# EasyEDA Pro project 数控buck.eprj

# Schematic Schematic1
Board Name: Board1; Create Date: 2025-03-31; Page Name: P1; Project Name: 数控buck; Schematic Name: Schematic1; Update Date: 2025-04-08; Company: 嘉立创EDA; Page Size: A4; Version: V1.0
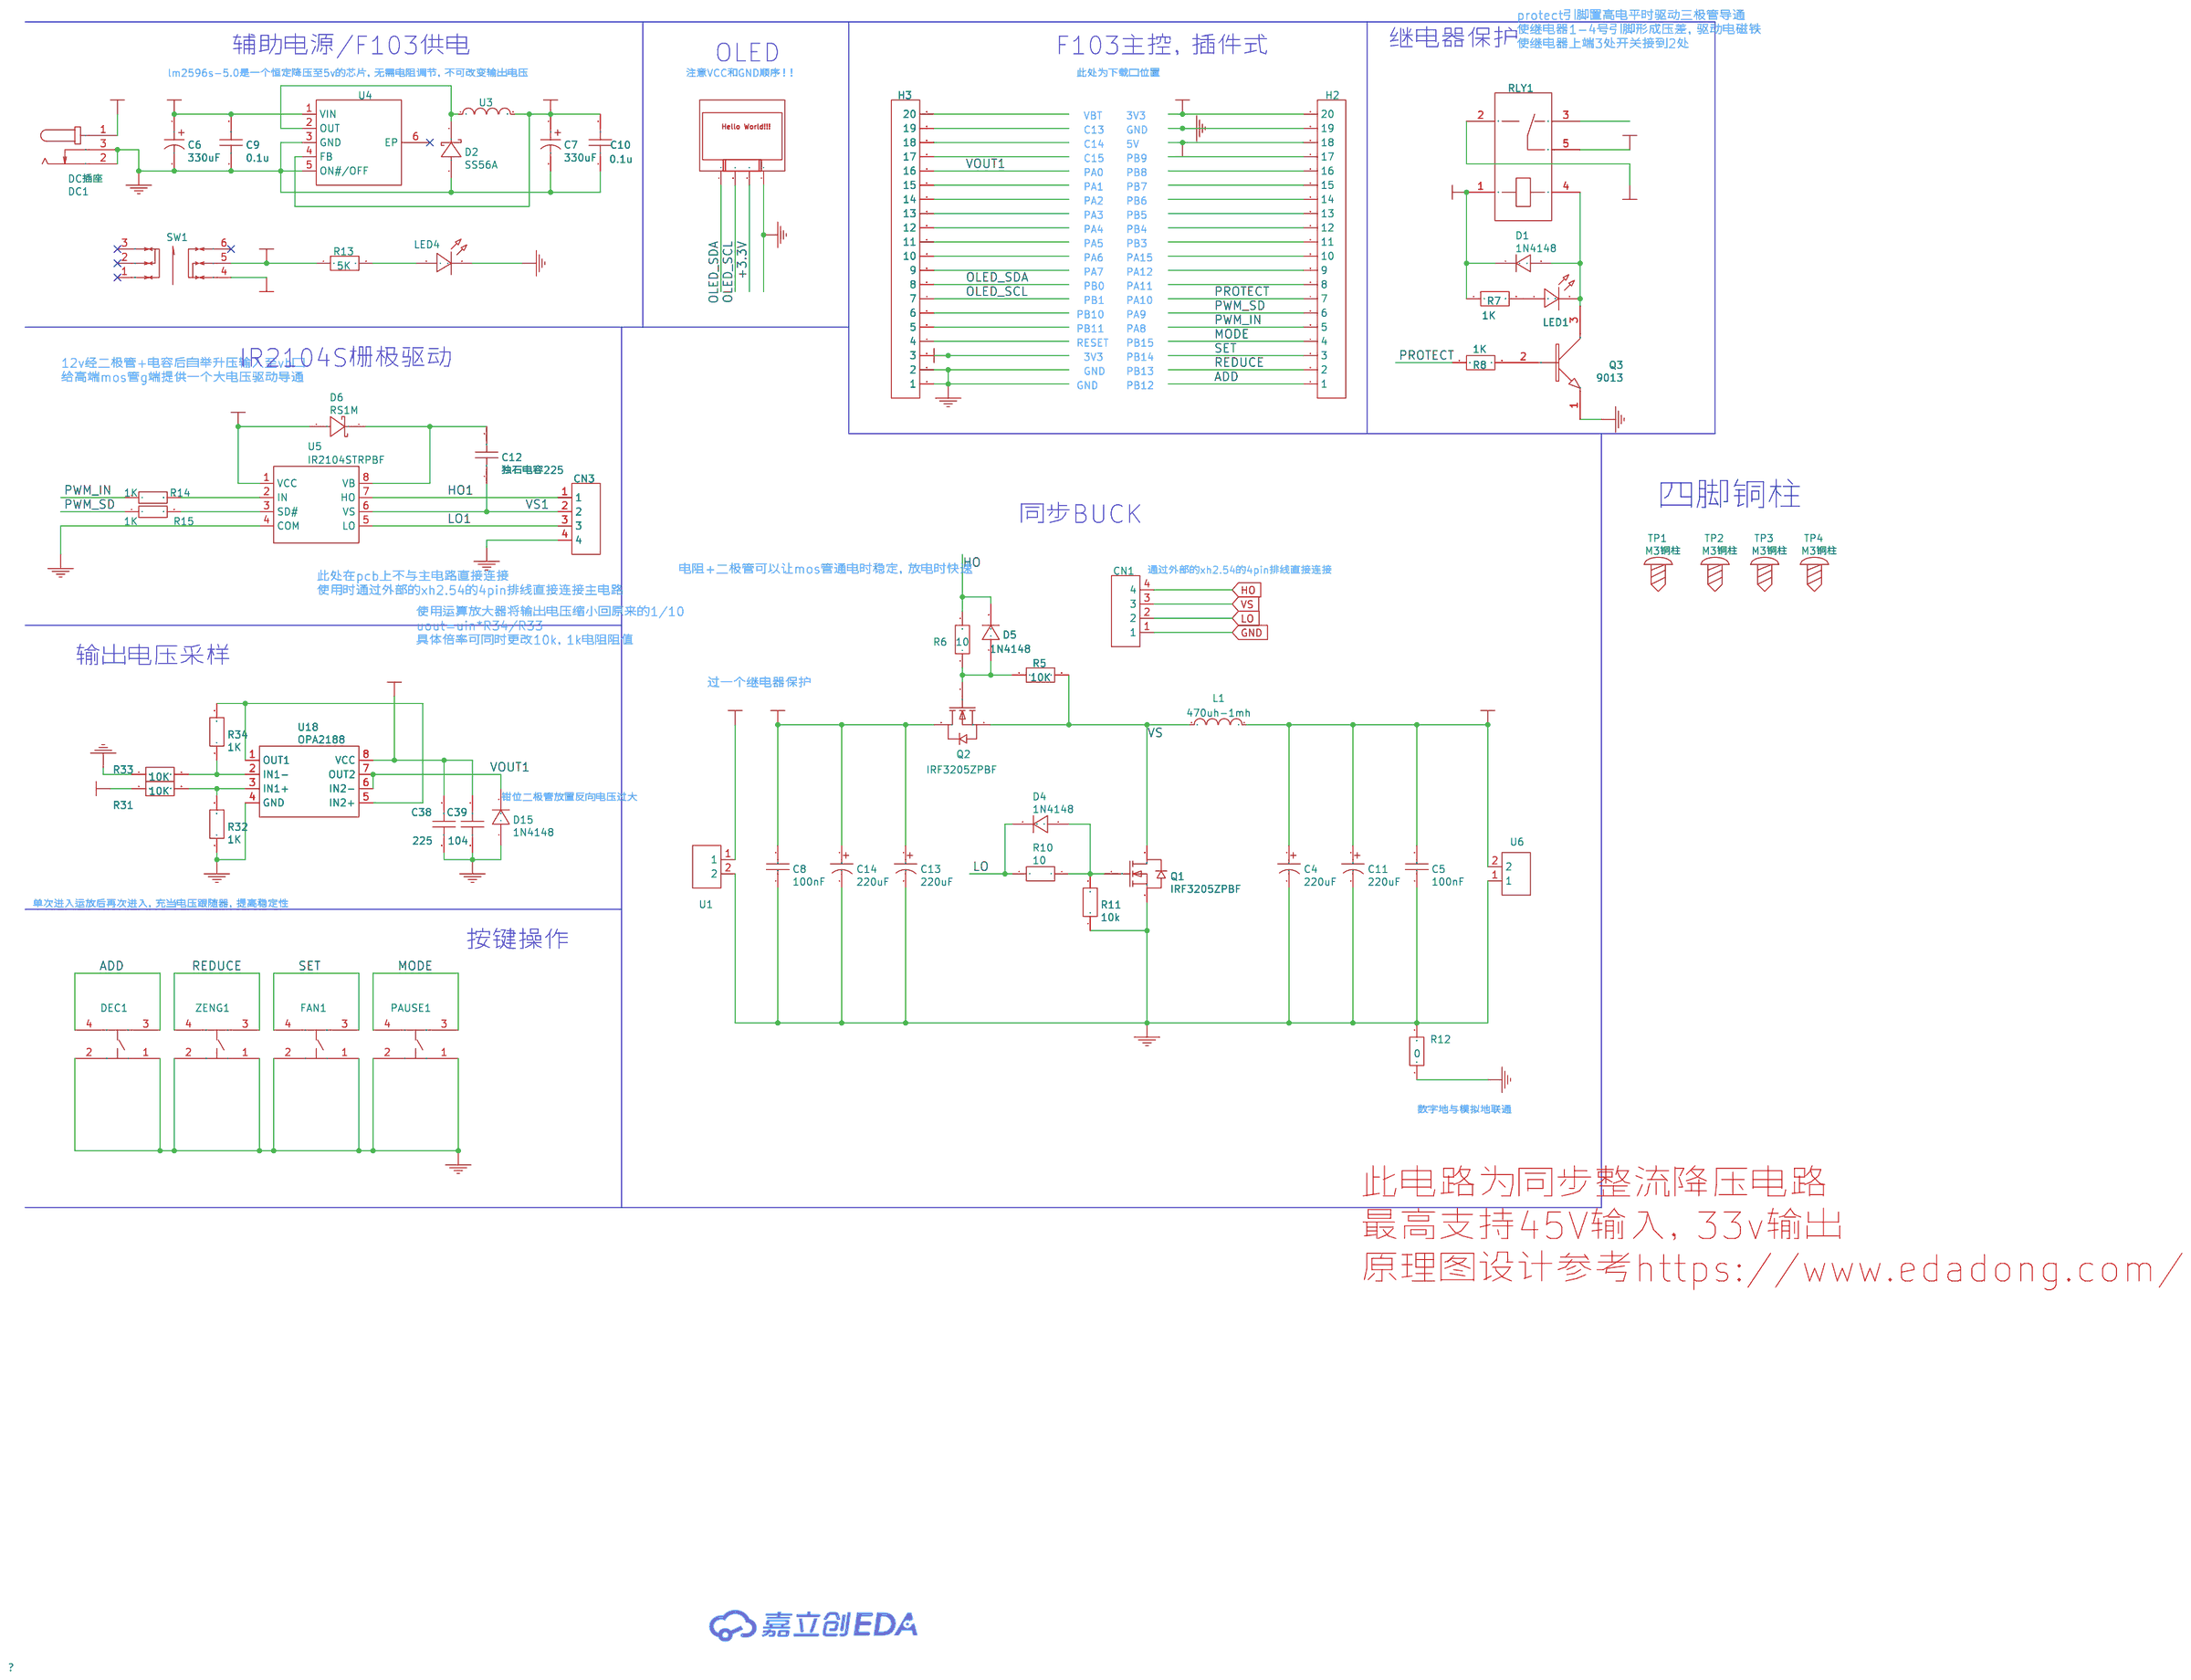
[diagram p0: schematic sheet]

## Parts
C4  220uF  [CAP-TH_BD10.0-P5.00-D1.0-FD]
C5  100nF  [CAP-TH_L8.5-W5.0-P5.00-D1.2]
C6  330uF  [CAP-SMD_BD10.0-L10.3-W10.3-LS11.0-R-RD]
C7  330uF  [CAP-SMD_BD10.0-L10.3-W10.3-LS11.0-R-RD]
C8  100nF  [CAP-TH_L8.5-W5.0-P5.00-D1.2]
C9  0.1u  [C0805]
C10  0.1u  [C0805]
C11  220uF  [CAP-TH_BD10.0-P5.00-D1.0-FD]
C12  独石电容225  [独石电容]
C13  220uF  [CAP-TH_BD10.0-P5.00-D1.0-FD]
C14  220uF  [CAP-TH_BD10.0-P5.00-D1.0-FD]
C38  225  [C0805]
C39  104  [C0805]
CN1  XH-4A_C2908602  [CONN-TH_XH2.50-4P]
CN3  XH-4A_C2908602  [CONN-TH_XH2.50-4P]
D1  1N4148  [DO-35_BD2.0-L4.2-P8.20-D0.5-RD]
D2  SS56A  [SMA_L4.2-W2.6-LS5.0-RD]
D4  1N4148  [DO-35_BD2.0-L4.0-P8.00-D0.5-FD]
D5  1N4148  [DO-35_BD2.0-L4.0-P8.00-D0.5-FD]
D6  RS1M  [SMA_L4.4-W2.8-LS5.4-RD]
D15  1N4148  [DO-35_BD2.0-L4.0-P8.00-D0.5-FD]
DC1  DC插座  [DC-IN-TH_DC-005-5A-2.0]
DEC1  6*6*5_C69330  [KEY-TH_4P-L6.0-W6.0-P4.50-LS6.5]
FAN1  6*6*5_C69330  [KEY-TH_4P-L6.0-W6.0-P4.50-LS6.5]
H2  HDR-F-2.54_1x20  [HDR-F-2.54_1X20]
H3  HDR-F-2.54_1x20  [HDR-F-2.54_1X20]
L1  470uh-1mh  [电感PCB]
LED1  LED-TH-3mm_R  [LED-TH_BD3.0_RED]
LED4  LED-TH-3mm_R  [LED-TH_BD3.0_RED]
OLED1  0.96OLED_4P  [0.96OLED_4P]
PAUSE1  6*6*5_C69330  [KEY-TH_4P-L6.0-W6.0-P4.50-LS6.5]
Q1  IRF3205ZPBF  [TO-220-3_L10.0-W4.5-P2.54-T]
Q2  IRF3205ZPBF  [TO-220-3_L10.0-W4.5-P2.54-T]
Q3  9013  [TO-92]
R5  10K  [R0805]
R6  10  [R0805]
R7  1K  [R0805]
R8  1K  [R0805]
R10  10  [R0805]
R11  10k  [R0805]
R12  0  [R0805]
R13  5K  [R0805]
R14  1K  [R0805]
R15  1K  [R0805]
R31  10K  [R0805]
R32  1K  [R0805]
R33  10K  [R0805]
R34  1K  [R0805]
RLY1  SRD-05VDC-SL-C  [RELAY-TH_SRD-XXVDC-XL-C]
SW1  XKB8080-Z  [SW-TH_6P-L8.0-W8.0-P2.50]
TP1  M3铜柱  [M3铜柱]
TP2  M3铜柱  [M3铜柱]
TP3  M3铜柱  [M3铜柱]
TP4  M3铜柱  [M3铜柱]
U1  KF7.62-2P  [CONN-TH_KF7.62-2P]
U3  CDRH125L125NP-151MC  [IND-SMD_L12.0-W12.0_CDRH125L125NP-470MC]
U4  LM2596S-5.0  [TO-263-5_L10.2-W8.9-P1.70-BR]
U5  IR2104STRPBF  [SOIC-8_L4.9-W3.9-P1.27-LS6.0-BL]
U6  KF7.62-2P  [CONN-TH_KF7.62-2P]
U18  OPA2188  [SOP-8_L4.9-W3.9-P1.27-LS6.0-BL]
ZENG1  6*6*5_C69330  [KEY-TH_4P-L6.0-W6.0-P4.50-LS6.5]

## Library data of the parts
C4 C11 C13 C14 = 220uF: Supplier: LCSC; Manufacturer: CX(承兴); Manufacturer Part: KM227M050G13RR0VH2FP0; Supplier Part: C45105; JLCPCB Part Class: Extended Part
C5 C8 = 100nF: Supplier: LCSC; Manufacturer: FH; Manufacturer Part: CT4-0805Y104M500F3; Supplier Part: C94717; JLCPCB Part Class: Extended Part
C6 C7 = 330uF: Supplier: LCSC; Supplier Part: C542207; Manufacturer: PANASONIC(松下); Manufacturer Part: EEEFT1H331GP
C9 C10 = 0.1u
C12 = 225: Supplier: LCSC; Supplier Part: 独石电容5.08; Manufacturer: 独石电容5.08; Manufacturer Part: 独石电容5.08
C38 = 225
C39 = 104
CN1 CN3 = XH-4A_C2908602: Supplier: LCSC; Supplier Part: C2908602; Manufacturer: HCTL(华灿天禄); Manufacturer Part: XH-4A; JLCPCB Part Class: Extended Part
D1 = 1N4148: Supplier: LCSC; Supplier Part: C13769; Manufacturer: STMicroelectronics
D2 = SS56A: Supplier: LCSC; Supplier Part: C842793; Manufacturer: FUXINSEMI; JLCPCB Part Class: Extended Part
D4 D5 D15 = 1N4148: Supplier: LCSC; Manufacturer: SEMTECH; Supplier Part: C14516
D6 = RS1M: Supplier: LCSC; Supplier Part: C915738; Manufacturer: Agertech; Manufacturer Part: SS34AT
DC1 = DC插座: Supplier: LCSC; Supplier Part: C381116; Manufacturer: XKB Enterprise; Manufacturer Part: DC-005-5A-2.0
DEC1 FAN1 PAUSE1 ZENG1 = 6*6*5_C69330: Supplier: LCSC; Manufacturer: ReliaPro; Manufacturer Part: 6*6*5 直插环保260G 耐温复银; Supplier Part: C69330
H2 H3 = HDR-F-2.54_1x20: Supplier Part: C50984; Supplier: LCSC
L1 = 470uh-1mh
LED1 LED4 = LED-TH-3mm_R: Manufacturer: EVERLIGHT(台湾亿光); Manufacturer Part: 204-10SDRD/S530-A3-L; Supplier Part: C84774; Supplier: LCSC
OLED1 = 0.96OLED_4P: Supplier: LCSC
Q1 Q2 = IRF3205ZPBF: Supplier: LCSC; Manufacturer: Infineon; Supplier Part: C2612; JLCPCB Part Class: Extended Part
Q3 = 9013
R5 R31 R33 = 10K
R6 R10 = 10
R7 R8 R32 R34 = 1K
R11 = 10k
R12 = 0
R13 = 5K
R14 R15 = 1K: Supplier: LCSC; Supplier Part: C269727; Manufacturer: Tyohm; Manufacturer Part: RMC08051K5%N
RLY1 = SRD-05VDC-SL-C: Supplier: LCSC; Manufacturer: SONGLE; Supplier Part: C35449; JLCPCB Part Class: Extended Part
SW1 = XKB8080-Z: Supplier: LCSC; Supplier Part: C318860; Manufacturer: XKB Enterprise; JLCPCB Part Class: Extended Part
TP1-TP4 = M3铜柱
U1 U6 = KF7.62-2P: Supplier: LCSC; Supplier Part: C707824; Manufacturer: Cixi Kefa Elec; JLCPCB Part Class: Extended Part
U3 = CDRH125L125NP-151MC: Supplier: LCSC; Supplier Part: C2595958; Manufacturer: Sumida(胜美达); link: https://atta.szlcsc.com/upload/public/pdf/source/20180125/C167260_15168650590171302964.pdf; Inductance: 150uH
U4 = LM2596S-5.0: Supplier: LCSC; Supplier Part: C347421; Manufacturer: UMW(Youtai Semiconductor Co., Ltd.); JLCPCB Part Class: Extended Part
U5 = IR2104STRPBF: Supplier: LCSC; Manufacturer: IR; image: //image.lceda.cn/szlcsc/C2960.jpg; Supplier Part: C2960; Paste Type: recommend
U18 = OPA2188: Supplier: LCSC; Supplier Part: C3294649; Manufacturer: DOWO(东沃); Manufacturer Part: LM358

## Nets
+3.3V: H2.20 H3.3 OLED1.2
+5V: C7.1 C10.2 C38.1 C39.1 D1.1 H2.18 R7.1 RLY1.1 U3.2 U4.4(FB) U18.8(VCC)
+12V: C6.1 C9.2 D6.2(A) R13.1 SW1.5 U4.1(VIN) U5.1(VCC)
DGND: C6.2 C7.2 C9.1 C10.1 C38.2 C39.2 D2.2(A) D15.1 DC1.2 DC1.3 DEC1.1 DEC1.2 FAN1.1 FAN1.2 H2.19 H3.1 H3.2 LED4.2 OLED1.1 PAUSE1.1 PAUSE1.2 Q3.1(E) R12.1 U4.3(GND) U4.5(ON#/OFF) U5.4(COM) ZENG1.1 ZENG1.2
GND: C4.2 C5.1 C8.1 C11.2 C13.2 C14.2 CN1.1 Q1.3(S) R11.1 R12.2 R32.1 R33.1 U1.2 U6.1 U18.4(GND)
GND1: CN3.4
VCC: DC1.1 SW1.4
VIN: RLY1.5 U1.1
VIN_LATER: C8.2 C13.1 C14.1 Q2.2(D) RLY1.2
ADD: DEC1.3 DEC1.4 H2.1
HO: CN1.4 D5.2 R6.2
HO1: CN3.1 U5.7(HO)
LO: CN1.2 D4.2 R10.2
LO1: CN3.3 U5.5(LO)
MODE: H2.4 PAUSE1.3 PAUSE1.4
OLED_SCL: H3.7 OLED1.3
OLED_SDA: H3.8 OLED1.4
PROTECT: H2.7 R8.1
PWM_IN: H2.5 R14.1
PWM_SD: H2.6 R15.1
REDUCE: H2.2 ZENG1.3 ZENG1.4
SET: FAN1.3 FAN1.4 H2.3
VOUT: C4.1 C5.2 C11.1 L1.1 R31.1 U6.2
VOUT1: D15.2 H3.16 U18.6(IN2-) U18.7(OUT2)
VS: CN1.3 L1.2 Q1.2(D) Q2.3(S) R5.2
VS1: C12.1 CN3.2 U5.6(VS)
$1N20329: Q3.2(B) R8.2
$1N20344: D1.2 LED1.2 Q3.3(C) RLY1.4
$1N20345: LED1.1 R7.2
$1N20380: R33.2 R34.1 U18.2(IN1-)
$1N20381: R31.2 R32.2 U18.3(IN1+)
$1N20389: R34.2 U18.1(OUT1) U18.5(IN2+)
$1N20401: D2.1(K) U3.1 U4.2(OUT)
$1N20402: R14.2 U5.2(IN)
$1N20403: R15.2 U5.3(SD#)
$1N20406: C12.2 D6.1(K) U5.8(VB)
$1N20412: LED4.1 R13.2
$1N20418: D4.1 Q1.1(G) R10.1 R11.2
$1N20419: D5.1 Q2.1(G) R5.1 R6.1

Not connected (* = marked no-connect by the designer): H2 8 9 10 11 12 13 14 15 16 17; H3 4 5 6 9 10 11 12 13 14 15 17 18 19 20; RLY1 3; SW1 1* 2* 3* 6*; U4 6(EP)*

## Notes on the sheet
- 辅助电源/F103供电
- OLED
- F103主控，插件式
- 继电器保护
- protect引脚置高电平时驱动三极管导通
  使继电器1-4号引脚形成压差，驱动电磁铁
  使继电器上端3处开关接到2处
- lm2596s-5.0是一个恒定降压至5v的芯片，无需电阻调节，不可改变输出电压
- 注意VCC和GND顺序！！
- 此处为下载口位置
- VBT
- 3V3
- C13
- C14
- 5V
- GND
- C15
- PB9
- PA0
- PB8
- PA1
- PB7
- PA2
- PB6
- PA3
- PB5
- PA4
- PA5
- PB3
- PB4
- PA6
- PA15
- PA7
- PA12
- PB0
- PA11
- PB1
- PA10
- PB10
- PB11
- PA8
- PA9
- RESET
- PB15
- 3V3
- PB14
- 12v经二极管+电容后自举升压输入至vb口
  给高端mos管g端提供一个大电压驱动导通
- IR2104S栅极驱动
- GND
- PB13
- GND
- PB12
- 四脚铜柱
- 同步BUCK
- 电阻+二极管可以让mos管通电时稳定，放电时快速
- 通过外部的xh2.54的4pin排线直接连接
- 此处在pcb上不与主电路直接连接
  使用时通过外部的xh2.54的4pin排线直接连接主电路
- 使用运算放大器将输出电压缩小回原来的1/10
  uout=uin*R34/R33
  具体倍率可同时更改10k，1k电阻阻值
- 输出电压采样
- 过一个继电器保护
- 钳位二极管放置反向电压过大
- 单次进入运放后再次进入，充当电压跟随器，提高稳定性
- 按键操作
- 数字地与模拟地联通
- 此电路为同步整流降压电路
  最高支持45V输入，33v输出
  原理图设计参考https://www.edadong.com/

# Board PCB1
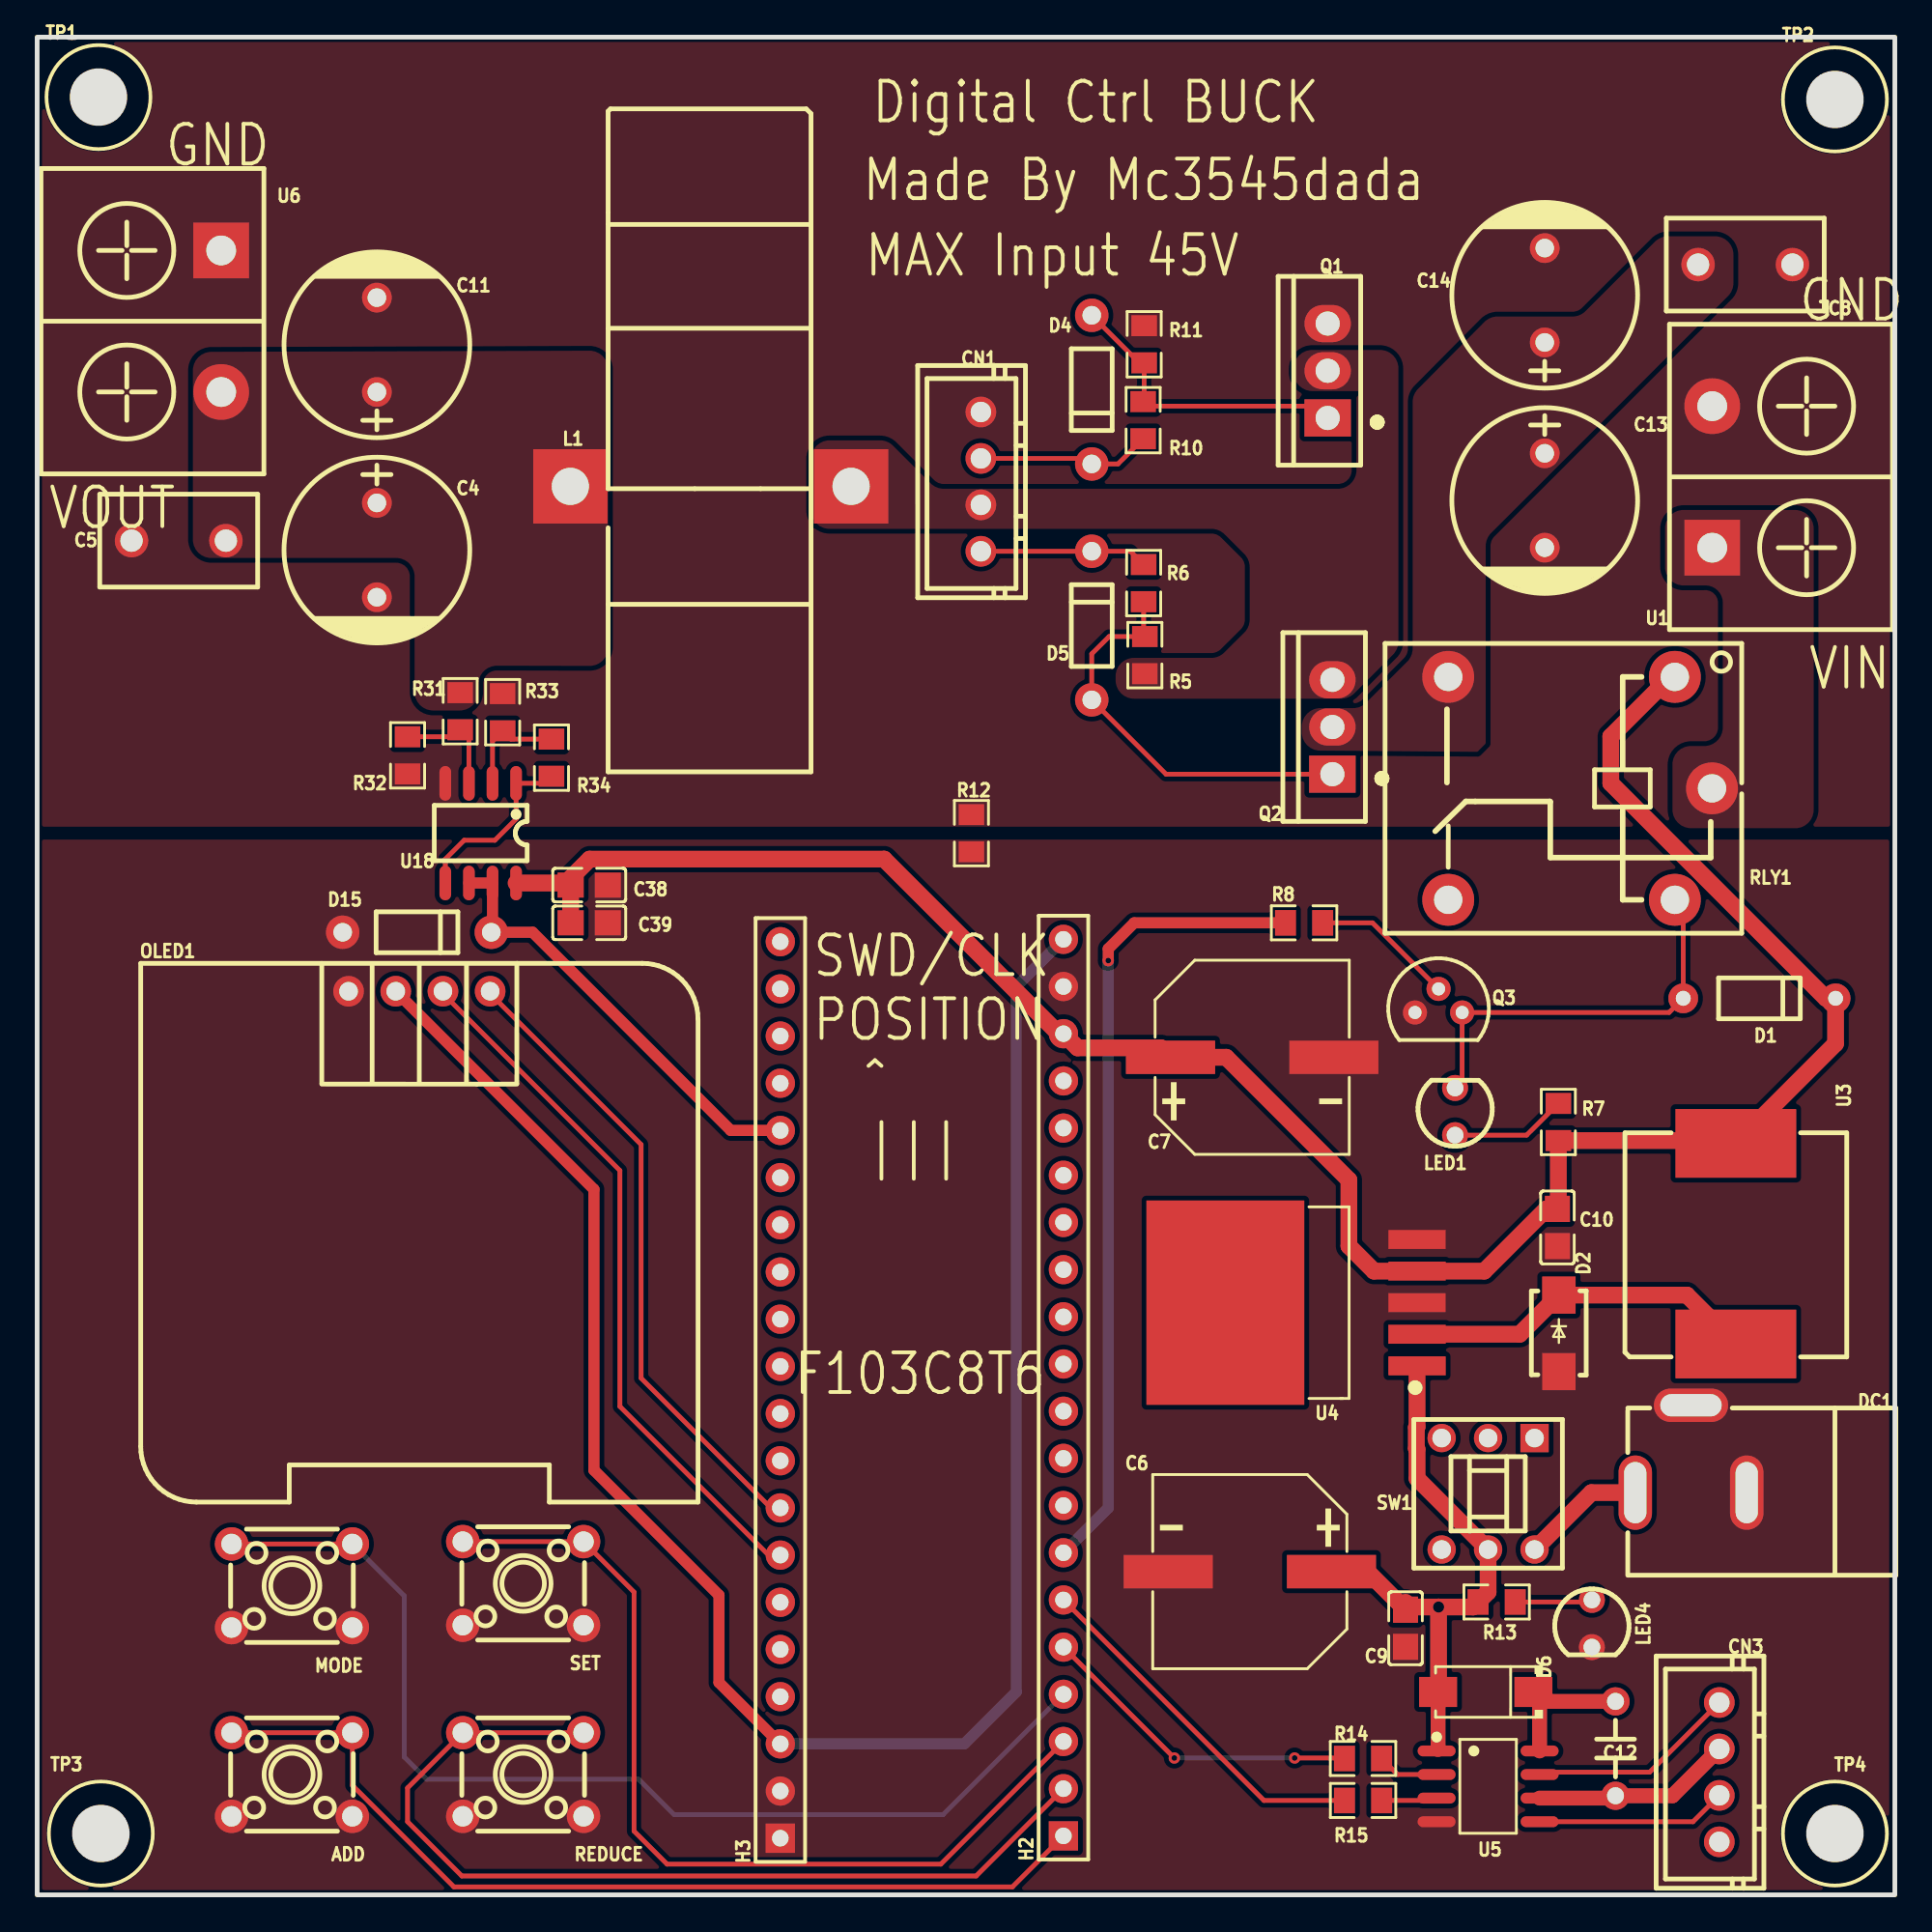
[diagram p1: board, top side]
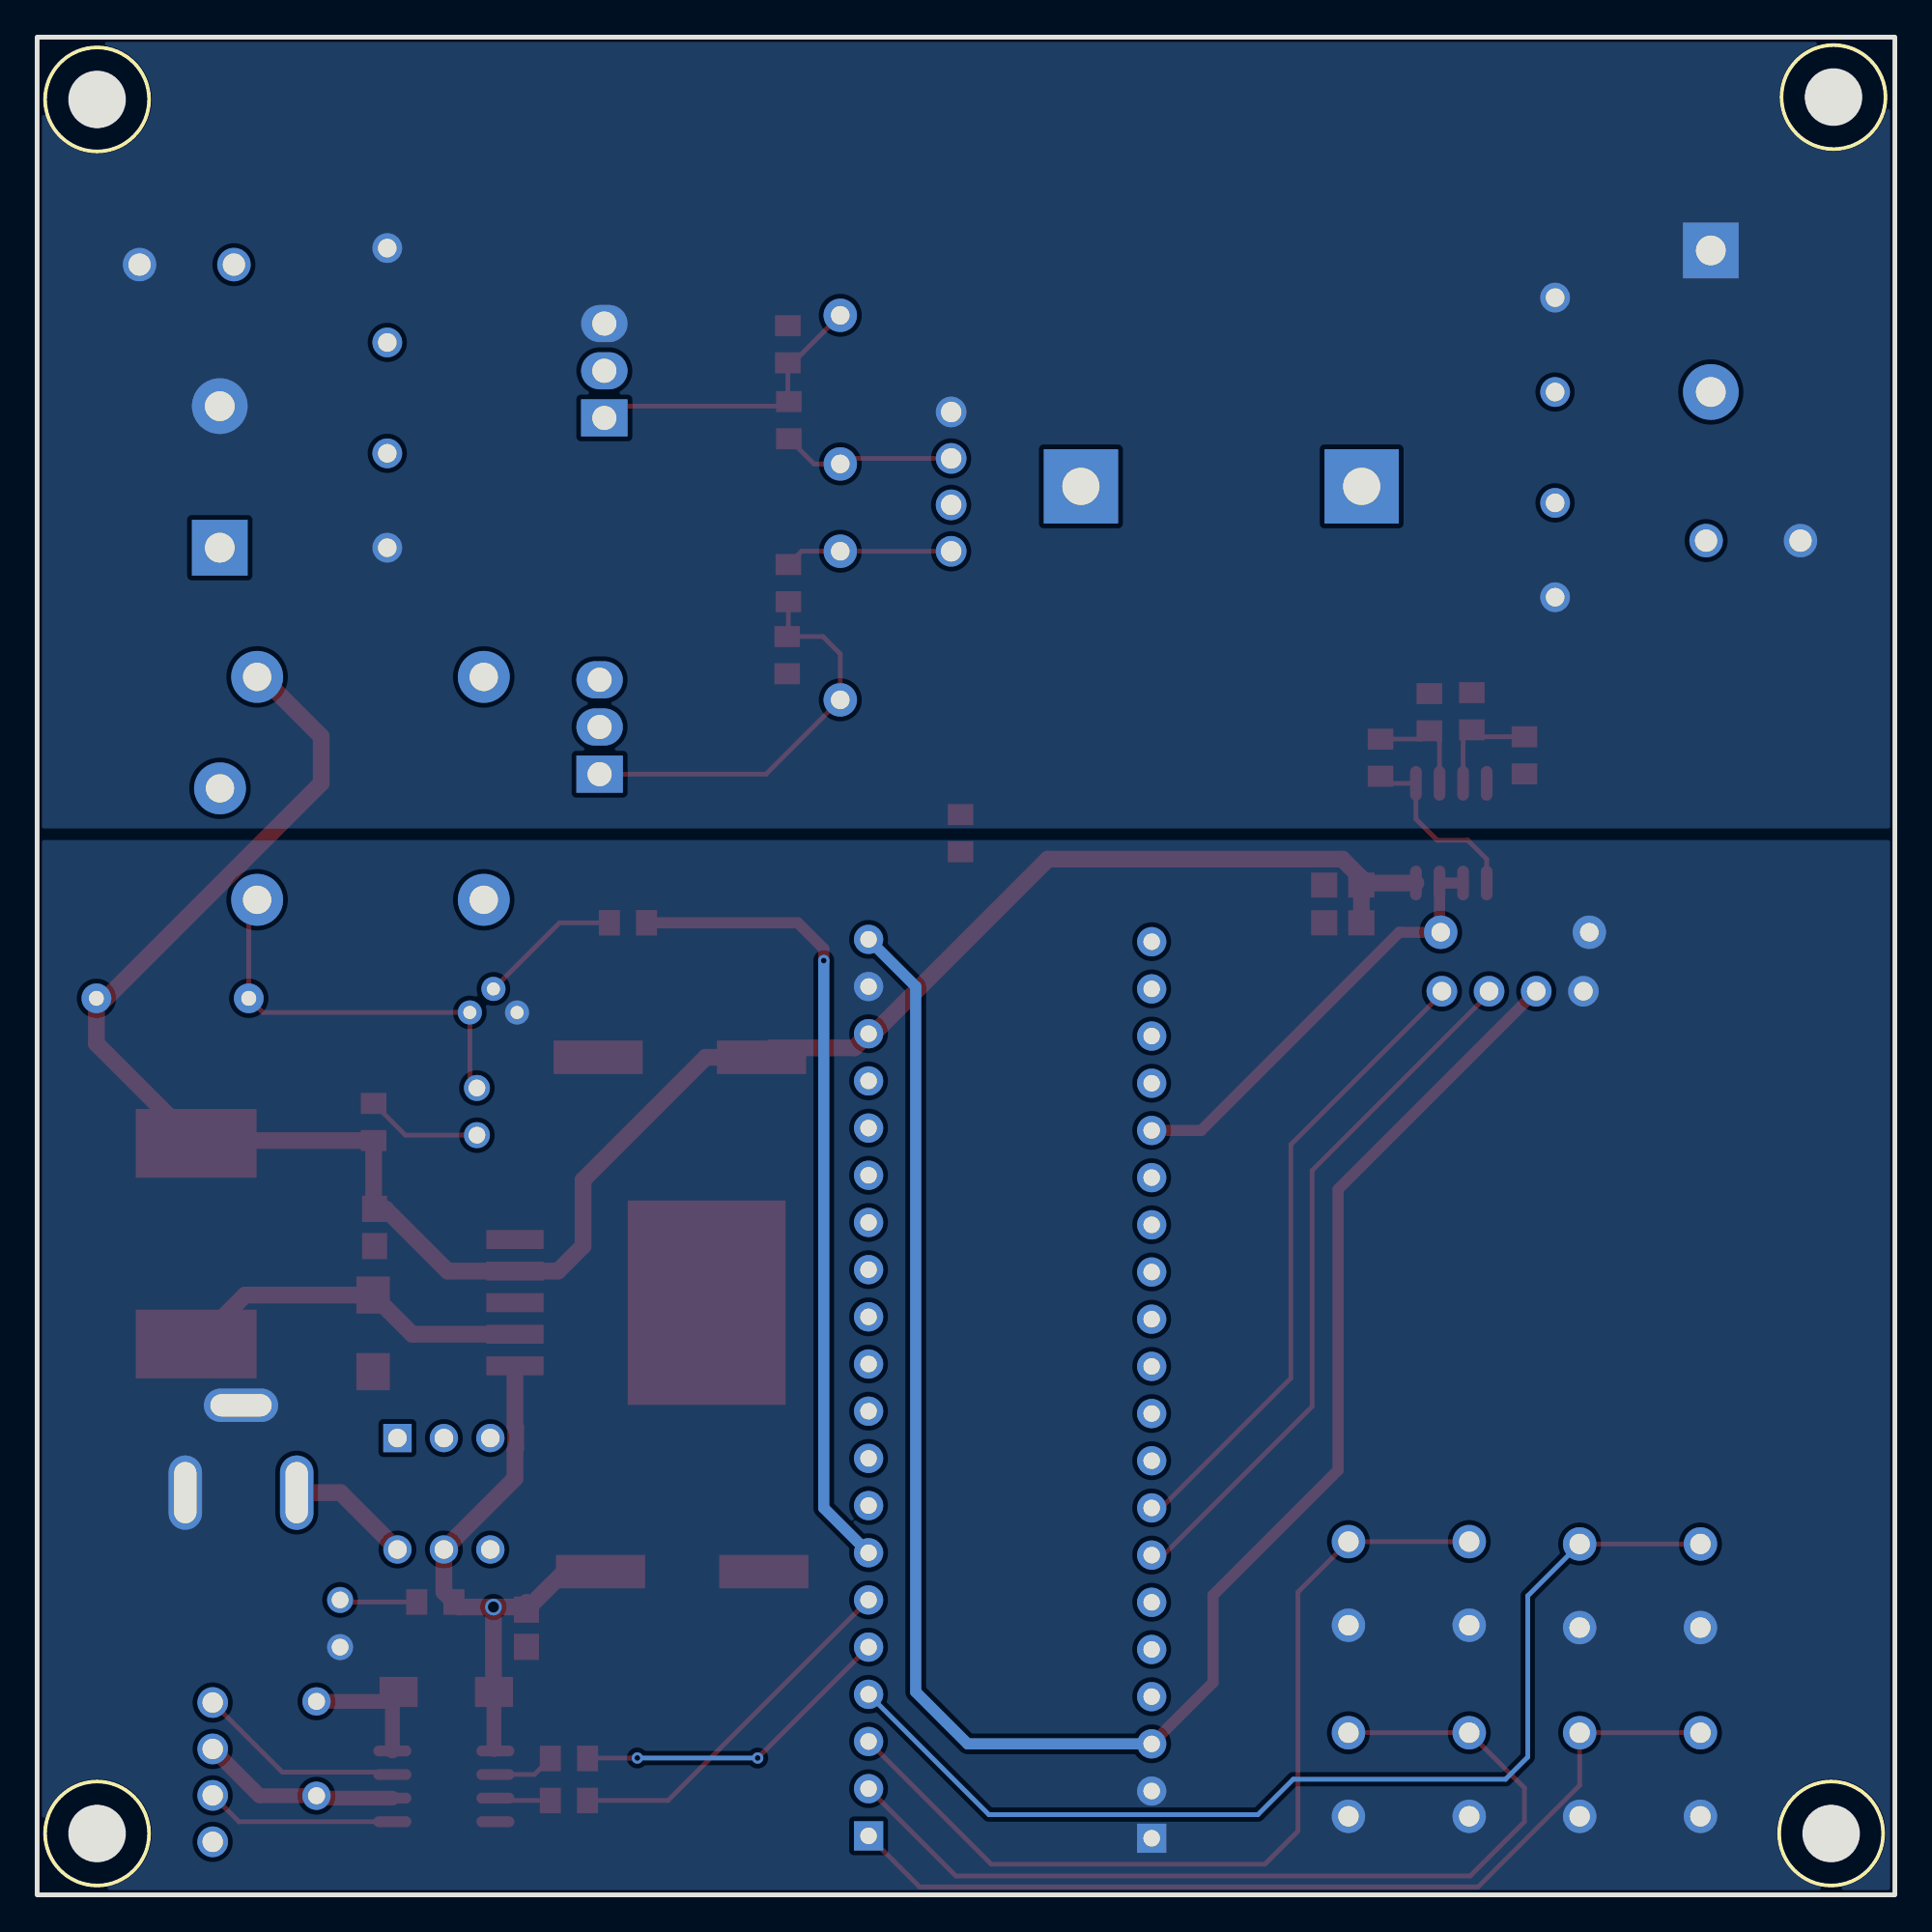
[diagram p2: board, bottom side, seen from below]

Outline 100 x 100 mm; copper layers: Top Layer, Bottom Layer. Coordinates in mm from the lower left corner of the outline.
Outline path: rectangle 0,100 100,0
Stack: Top Layer 0.035mm / Dielectric1 1.51mm FR4 er 4.5 / Bottom Layer 0.035mm

## Design rules (mm)
template: 自定义配置
spacing copperThickness1oz (default): track to track 0.102, other pairs 0.152 to 0.3
spacing copperThickness2oz: track to track 0.203, other pairs 0.152 to 0.3
track width copperThickness1oz (default): min 0.127, default 0.254, max 2.54
track width copperThickness2oz: min 0.203, default 0.254, max 2.54
differential pair differentialPair (default): width min 0.127, default 0.254, max 2.54; gap min 0.152, default 0.152
via viaSize (default): diameter min 0.5, default 0.61, max 10; hole min 0.3, default 0.305, max 6.3
pour e859 uses copperRegion

## Placement (name value [footprint] x y rotation side)
ADD  6*6*5_C69330  [KEY-TH_4P-L6.0-W6.0-P4.50-LS6.5]  13.72 6.48 0 top
C4  220uF  [CAP-TH_BD10.0-P5.00-D1.0-FD]  18.29 72.39 270 top
C5  100nF  [CAP-TH_L8.5-W5.0-P5.00-D1.2]  7.62 72.9 0 top
C6  330uF  [CAP-SMD_BD10.0-L10.3-W10.3-LS11.0-R-RD]  65.28 17.4 0 top
C7  330uF  [CAP-SMD_BD10.0-L10.3-W10.3-LS11.0-R-RD]  65.41 45.08 180 top
C8  100nF  [CAP-TH_L8.5-W5.0-P5.00-D1.2]  91.95 87.76 180 top
C9  0.1u  [C0805]  73.66 14.35 90 top
C10  0.1u  [C0805]  81.84 35.92 90 top
C11  220uF  [CAP-TH_BD10.0-P5.00-D1.0-FD]  18.29 83.44 90 top
C12  独石电容225  [独石电容]  84.96 7.87 90 top
C13  220uF  [CAP-TH_BD10.0-P5.00-D1.0-FD]  81.15 75.06 270 top
C14  220uF  [CAP-TH_BD10.0-P5.00-D1.0-FD]  81.15 86.11 90 top
C38  225  [C0805]  29.72 54.36 0 top
C39  104  [C0805]  29.72 52.32 0 top
CN1  XH-4A_C2908602  [CONN-TH_XH2.50-4P]  50.8 76.07 270 top
CN3  XH-4A_C2908602  [CONN-TH_XH2.50-4P]  90.55 6.6 270 top
D1  1N4148  [DO-35_BD2.0-L4.2-P8.20-D0.5-RD]  92.71 48.26 180 top
D2  SS56A  [SMA_L4.2-W2.6-LS5.0-RD]  81.91 30.23 270 top
D4  1N4148  [DO-35_BD2.0-L4.0-P8.00-D0.5-FD]  56.77 81.03 270 top
D5  1N4148  [DO-35_BD2.0-L4.0-P8.00-D0.5-FD]  56.77 68.33 90 top
D6  RS1M  [SMA_L4.4-W2.8-LS5.4-RD]  77.98 10.92 180 top
D15  1N4148  [DO-35_BD2.0-L4.0-P8.00-D0.5-FD]  20.45 51.82 0 top
DC1  DC插座  [DC-IN-TH_DC-005-5A-2.0]  89.03 24 180 top
H2  HDR-F-2.54_1x20  [HDR-F-2.54_1X20]  55.25 27.31 90 top
H3  HDR-F-2.54_1x20  [HDR-F-2.54_1X20]  40 27.18 90 top
L1  470uh-1mh  [电感PCB]  28.7 75.82 0 top
LED1  LED-TH-3mm_R  [LED-TH_BD3.0_RED]  76.33 42.16 180 top
LED4  LED-TH-3mm_R  [LED-TH_BD3.0_RED]  83.69 14.6 0 top
MODE  6*6*5_C69330  [KEY-TH_4P-L6.0-W6.0-P4.50-LS6.5]  13.72 16.64 0 top
OLED1  -  [0.96OLED_4P]  20.57 48.64 0 top
Q1  IRF3205ZPBF  [TO-220-3_L10.0-W4.5-P2.54-T]  69.47 82.04 180 top
Q2  IRF3205ZPBF  [TO-220-3_L10.0-W4.5-P2.54-T]  69.72 62.86 180 top
Q3  9013  [TO-92]  75.44 47.5 90 top
R5  10K  [R0805]  59.63 66.73 270 top
R6  10  [R0805]  59.56 70.61 90 top
R7  1K  [R0805]  81.89 41.6 90 top
R8  1K  [R0805]  68.2 52.32 0 top
R10  10  [R0805]  59.54 79.38 270 top
R11  10k  [R0805]  59.59 83.47 270 top
R12  0  [R0805]  50.29 57.15 90 top
R13  5K  [R0805]  78.56 15.76 0 top
R14  1K  [R0805]  71.37 7.34 0 top
R15  1K  [R0805]  71.37 5.08 0 top
R31  10K  [R0805]  22.77 63.72 270 top
R32  1K  [R0805]  19.94 61.34 90 top
R33  10K  [R0805]  25.06 63.66 270 top
R34  1K  [R0805]  27.69 61.21 270 top
REDUCE  6*6*5_C69330  [KEY-TH_4P-L6.0-W6.0-P4.50-LS6.5]  26.16 6.48 0 top
RLY1  SRD-05VDC-SL-C  [RELAY-TH_SRD-XXVDC-XL-C]  83.06 59.56 180 top
SET  6*6*5_C69330  [KEY-TH_4P-L6.0-W6.0-P4.50-LS6.5]  26.16 16.76 0 top
SW1  XKB8080-Z  [SW-TH_6P-L8.0-W8.0-P2.50]  78.1 21.59 180 top
TP1  -  [M3铜柱]  3.3 96.77 0 top
TP2  -  [M3铜柱]  96.77 96.65 0 top
TP3  -  [M3铜柱]  3.43 3.3 0 top
TP4  -  [M3铜柱]  96.77 3.3 0 top
U1  KF7.62-2P  [CONN-TH_KF7.62-2P]  90.17 76.33 90 top
U3  CDRH125L125NP-151MC  [IND-SMD_L12.0-W12.0_CDRH125L125NP-470MC]  91.44 35.05 270 top
U4  LM2596S-5.0  [TO-263-5_L10.2-W8.9-P1.70-BR]  69.12 31.88 0 top
U5  IR2104STRPBF  [SOIC-8_L4.9-W3.9-P1.27-LS6.0-BL]  78.1 5.84 270 top
U6  KF7.62-2P  [CONN-TH_KF7.62-2P]  9.91 84.71 270 top
U18  OPA2188  [SOP-8_L4.9-W3.9-P1.27-LS6.0-BL]  23.88 57.15 180 top

## Footprints (pads in the part's own frame, mm; a bottom-side part is the same pattern mirrored in y, then rotated)
0.96OLED_4P
  round 1.65 hole 1: 1(-3.81,-0.002) 2(-1.27,0.002) 3(1.27,0.002) 4(3.81,0.002)
C0805
  rect 1.41x1.35 smd: 1(-1,0) 2(1,0)
CAP-SMD_BD10.0-L10.3-W10.3-LS11.0-R-RD
  rect 4.8x1.8 smd: 1(4.395,0) 2(-4.395,0)
CAP-TH_BD10.0-P5.00-D1.0-FD
  round 1.6 hole 1: 1(-2.54,0) 2(2.54,0)
CAP-TH_L8.5-W5.0-P5.00-D1.2
  round 1.8 hole 1.2: 1(-2.54,0) 2(2.54,0)
CONN-TH_KF7.62-2P
  rect 3x3 hole 1.6: 1(-3.81,0)
  round 3 hole 1.6: 2(3.81,0)
CONN-TH_XH2.50-4P
  round 1.65 hole 1.1: 1(-3.75,0) 2(-1.25,0) 3(1.25,0) 4(3.75,0)
DC-IN-TH_DC-005-5A-2.0
  oval 1.8x4 hole 1.2x3.3: 1(3,2.352) 2(-3,2.352)
  oval 4x1.8 hole 3.3x1.2: 3(-0.001,-2.352)
DO-35_BD2.0-L4.0-P8.00-D0.5-FD
  round 1.8 hole 1: 1(-4,0) 2(4,0)
DO-35_BD2.0-L4.2-P8.20-D0.5-RD
  round 1.6 hole 0.8: 1(-4.1,0) 2(4.1,0)
HDR-F-2.54_1X20
  rect 1.575x1.575 hole 0.889: 1(-24.13,0)
  round 1.575 hole 0.889: 2(-21.59,0) 3(-19.05,0) 4(-16.51,0) 5(-13.97,0) 6(-11.43,0) 7(-8.89,0) 8(-6.35,0) 9(-3.81,0) 10(-1.27,0) 11(1.27,0) 12(3.81,0) 13(6.35,0) 14(8.89,0) 15(11.43,0) 16(13.97,0) 17(16.51,0) 18(19.05,0) 19(21.59,0) 20(24.13,0)
IND-SMD_L12.0-W12.0_CDRH125L125NP-470MC
  rect 3.7x6.5 smd: 1(5.4,0) 2(-5.4,0)
KEY-TH_4P-L6.0-W6.0-P4.50-LS6.5
  round 1.8 hole 1.1: 1(-3.251,-2.251) 2(3.251,-2.251) 3(3.251,2.251) 4(-3.251,2.251)
LED-TH_BD3.0_RED
  round 1.4 hole 0.9: 1(0,1.27) 2(0,-1.27)
R0805
  rect 1.133x1.377 smd: 1(-1,0) 2(1,0)
RELAY-TH_SRD-XXVDC-XL-C
  round 2.794 hole 1.524: 1(-5.1,-6) 2(7.1,-6) 3(7.1,6) 4(-5.1,6) 5(-7.1,0)
SMA_L4.2-W2.6-LS5.0-RD
  rect 2x1.8 smd: 1(-2.06,0) 2(2.06,0)
SMA_L4.4-W2.8-LS5.4-RD
  rect 2.046x1.62 smd: 1(-2.566,0) 2(2.566,0)
SOIC-8_L4.9-W3.9-P1.27-LS6.0-BL
  oval 0.588x2.045 smd: 1(-1.905,-2.772) 2(-0.635,-2.772) 3(0.635,-2.772) 4(1.905,-2.772) 5(1.905,2.772) 6(0.635,2.772) 7(-0.635,2.772) 8(-1.905,2.772)
SOP-8_L4.9-W3.9-P1.27-LS6.0-BL
  oval 0.63x1.865 smd: 1(-1.905,-2.683) 2(-0.635,-2.683) 3(0.635,-2.683) 4(1.905,-2.683) 5(1.905,2.683) 6(0.635,2.683) 7(-0.635,2.683) 8(-1.905,2.683)
SW-TH_6P-L8.0-W8.0-P2.50
  rect 1.524x1.524 hole 1: 1(-2.5,-3)
  round 1.524 hole 1: 2(0.001,-3) 3(2.5,-3) 4(-2.5,3) 5(0.001,3) 6(2.5,3)
TO-92
  round 1.3 hole 0.705x0.7: 1(0,1.27) 2(1.27,0) 3(0,-1.27)
TO-220-3_L10.0-W4.5-P2.54-T
  rect 2.5x2 hole 1.3: 1(0,2.54)
  oval 2.5x2 hole 1.3: 2(0,0) 3(0,-2.54)
TO-263-5_L10.2-W8.9-P1.70-BR
  rect 3.083x1.02 smd: 1(5.16,-3.4) 2(5.16,-1.7) 3(5.16,0) 4(5.16,1.7) 5(5.16,3.4)
  rect 8.5x11 smd: 6(-5.16,0)
独石电容
  round 1.524 hole 0.914: 1(-2.54,0) 2(2.54,0)
电感PCB
  rect 4x4 hole 2: 1(0,0) 2(15.113,0)

## Nets
As in the schematic, except:
DGND: ADD.1 ADD.2 C6.2 C7.2 C9.1 C10.1 C38.2 C39.2 D2.2 D15.1 DC1.2 DC1.3 H2.19 H3.1 H3.2 LED4.2 MODE.1 MODE.2 OLED1.1 Q3.1 R12.1 REDUCE.1 REDUCE.2 SET.1 SET.2 U4.3 U4.5 U5.4
ADD: ADD.3 ADD.4 H2.1
MODE: H2.4 MODE.3 MODE.4
REDUCE: H2.2 REDUCE.3 REDUCE.4
SET: H2.3 SET.3 SET.4

Pads without a net: SW1 1 2 3 6; U4 6

## Via types
v1: diameter 0.9, hole 0.6, Top Layer to Bottom Layer, 1 via
v2: diameter 0.61, hole 0.305, Top Layer to Bottom Layer, 3 vias

## Routing (per net, layer and track width the routed paths; a pad name or vN(x,y) marks a point on that pad's centre or on a via; arc(x,y) is an arc through that point)
+3.3V: length 104.5
  Top Layer w0.6: OLED1.2 29.97,37.97 29.97,22.86 36.7,16.13 36.7,11.43 H3.3
  Bottom Layer w0.6: H3.3 49.91,8.13 52.71,10.92 52.71,48.89 H2.20
+5V: length 119.1
  Top Layer w0.9: C38.1 28.61,54.47 U18.8 ; C38.1 28.72,54.73 29.74,55.75 45.59,55.75 54.99,46.36 H2.18 56.01,45.59 60.5,45.59 C7.1 64.01,45.08 70.61,38.48 70.61,34.92 71.96,33.58 77.9,33.58 81.25,36.92 C10.2 81.89,36.97 R7.1 91.29,40.6 U3.2 96.81,45.82 D1.1 96.29,48.26 84.71,59.84 84.71,62.36 87.91,65.56 RLY1.1 ; C38.1 C39.1
+12V: length 31.3
  Top Layer w0.6: 75.41,7.83 U5.1
  Top Layer w0.8: D6.2 75.41,7.83
  Top Layer w0.9: v1(75.44,15.49) 75.44,10.95 D6.2 ; v1(75.44,15.49) 73.91,15.49 73.66,15.75 ; v1(75.44,15.49) 77.29,15.49 R13.1 78.1,16.3 SW1.5 74.28,22.41 74.28,23.99 74.24,24.03 74.24,25.16 74.28,25.19 U4.1 ; C9.2 71.61,17.4 C6.1
VCC: length 6.7
  Top Layer w0.9: SW1.4 83.67,21.65 86.03,21.65
ADD: length 51
  Top Layer w0.254: ADD.4 ADD.3 16.97,5.89 22.43,0.43 52.5,0.43 H2.1
HO: length 9.1
  Top Layer w0.254: CN1.4 56.77,72.32 D5.2 58.85,72.33 R6.2
HO1: length 11.3
  Top Layer w0.254: U5.7 81,6.6 86.8,6.6 CN3.1
LO: length 9.4
  Top Layer w0.254: CN1.2 56.47,77.32 D4.2 58.18,77.03 R10.2
LO1: length 10.3
  Top Layer w0.254: U5.5 89.13,3.94 CN3.3
MODE: length 58.6
  Top Layer w0.254: MODE.4 MODE.3
  Bottom Layer w0.254: H2.4 48.77,4.32 34.29,4.32 32.38,6.22 20.95,6.22 19.76,7.42 19.76,16.09 MODE.3
OLED_SCL: length 38.1
  Top Layer w0.254: H3.7 39.37,18.29 31.37,26.29 31.37,38.99 21.84,48.52
OLED_SDA: length 34.5
  Top Layer w0.254: 24.38,48.52 32.51,40.39 32.51,27.81 39.5,20.83 H3.8
PROTECT: length 43.6
  Top Layer w0.6: v2(57.66,50.29) 57.66,50.93 59.06,52.32 R8.1
  Bottom Layer w0.6: H2.7 57.66,20.83 v2(57.66,50.29)
PWM_IN: length 17.6
  Top Layer w0.254: R14.1 70.35,7.37 v2(67.69,7.37) ; H2.5 v2(61.21,7.37)
  Bottom Layer w0.254: v2(61.21,7.37) v2(67.69,7.37)
PWM_SD: length 19.6
  Top Layer w0.254: R15.1 66.04,5.08 H2.6
REDUCE: length 51
  Top Layer w0.254: REDUCE.3 REDUCE.4 19.94,5.76 19.94,3.94 22.86,1.02 50.55,1.02 H2.2
SET: length 49.8
  Top Layer w0.254: H2.3 48.64,1.65 33.91,1.65 32.13,3.43 32.13,16.3 SET.3 SET.4
VOUT1: length 23.9
  Top Layer w0.6: H3.16 37.34,41.15 26.67,51.82 D15.2 24.51,51.88 U18.7 U18.6
VS1: length 10.8
  Top Layer w0.6: 90.39,7.69 CN3.2
  Top Layer w0.8: U5.6 84.84,5.21 C12.1 88.03,5.33 90.39,7.69
$1N20329: length 7.7
  Top Layer w0.254: R8.2 71.88,52.32 Q3.2
$1N20344: length 21.9
  Top Layer w0.254: LED1.2 76.71,43.81 Q3.3 87.85,47.5 D1.2 88.61,53.11 RLY1.4
$1N20345: length 6.3
  Top Layer w0.254: R7.2 80.18,40.89 LED1.1
$1N20380: length 5.9
  Top Layer w0.254: R34.1 25.5,62.21 R33.2 24.51,62.12 U18.2
$1N20381: length 6.1
  Top Layer w0.254: R32.2 22.4,62.34 R31.2 23.24,62.25 U18.3
$1N20389: length 10
  Top Layer w0.254: R34.2 27.3,59.83 U18.1 25.78,57.91 24.64,56.77 22.99,56.77 21.97,55.75 U18.5
$1N20401: length 19.1
  Top Layer w0.9: 74.28,30.18 79.81,30.18 D2.1 88.81,32.29 U3.1
$1N20402: length 3.3
  Top Layer w0.254: U5.2 73.24,6.48 R14.2
$1N20403: length 3
  Top Layer w0.254: U5.3 75.21,5.08 R15.2
$1N20406: length 7.5
  Top Layer w0.8: C12.2 81.05,10.41 80.88,10.59 ; 80.88,10.59 U5.8 ; 80.88,10.59 D6.1
$1N20412: length 4.2
  Top Layer w0.254: R13.2 83.58,15.76 LED4.1
$1N20418: length 16.3
  Top Layer w0.254: D4.1 59.33,82.47 R11.2 59.59,80.44 R10.1 59.78,80.14 68.83,80.14 Q1.1
$1N20419: length 22.2
  Top Layer w0.254: R6.1 59.56,67.8 R5.1 57.7,67.73 56.77,66.8 D5.1 60.77,60.33 Q2.1

## Copper pours and planes (outline as drawn; the poured copper is in the pictures)
DGND on Top Layer: 0,56.81 99.7,56.81 99.7,0 0,0
DGND on Bottom Layer: 0,56.78 100,56.78 100,0 0,0
GND on Top Layer: -0.21,100 100,100 100,57.5 -0.21,57.5
GND on Bottom Layer: 0,100 99.82,100 99.82,57.4 0,57.4
VIN on Top Layer: 88.63,70.48 87.92,70.78 87.63,71.48 87.63,73.55 87.92,74.26 88.63,74.55 94.63,74.55 95.34,74.26 95.63,73.55 95.63,58.42 95.34,57.71 94.63,57.42 89.03,57.42 88.32,57.71 88.03,58.42 88.03,60.84 88.32,61.55 89.03,61.84 89.74,61.84 90.44,62.14 90.74,62.84 90.74,69.48 90.46,70.21 89.74,70.48
VOUT on Top Layer: 29.73,83.12 30.44,82.83 30.73,82.12 30.73,67.15 30.44,66.44 29.73,66.15 24.75,66.16 24.04,65.87 23.75,65.16 23.75,64.75 23.46,64.05 22.75,63.75 21.32,63.75 20.61,64.05 20.32,64.75 20.32,70.96 20.03,71.67 19.32,71.96 9.38,71.96 8.67,72.26 8.38,72.96 8.38,82.06 8.67,82.77 9.38,83.06
VIN_LATER on Top Layer: 91.31,88.28 91.02,88.99 90.31,89.28 87.79,89.28 87.41,89.2 87.08,88.99 83.35,85.26 83.03,85.04 82.64,84.96 78.61,84.96 78.23,84.89 77.9,84.67 74.33,81.06 74.12,80.74 74.04,80.36 74.04,67.09 73.96,66.71 73.75,66.38 71.54,64.17 71.22,63.96 70.83,63.88 69.07,63.88 68.36,63.59 68.07,62.88 68.07,62.59 68.36,61.89 69.06,61.59 77.53,61.53 77.98,61.98 77.98,72.61 78.05,72.99 78.27,73.31 91.02,86.06 91.24,86.39 91.31,86.77
VS on Top Layer: 72.28,83.16 72.99,82.87 73.28,82.16 73.28,67.47 73.2,67.09 72.99,66.76 70.91,64.68 70.58,64.47 70.2,64.39 59.05,64.39 58.35,64.68 58.05,65.39 58.05,65.59 58.35,66.3 59.05,66.59 63.2,66.59 63.59,66.67 63.91,66.88 64.98,67.95 65.19,68.27 65.27,68.66 65.27,71.48 65.19,71.86 64.98,72.18 63.92,73.24 63.6,73.46 63.21,73.53 42.66,73.53 41.95,73.83 41.66,74.53 41.66,77.3 41.95,78 42.66,78.3 45.37,78.3 45.75,78.22 46.08,78 48.09,75.98 48.42,75.77 48.8,75.69 70.02,75.69 70.72,75.98 71.02,76.69 71.02,80.62 71.25,80.85 71.15,80.95 68.64,80.95 67.93,81.24 67.64,81.95 67.64,82.16 67.93,82.87 68.64,83.16

## Text on the board
Top Silkscreen Layer: VOUT | GND | F103C8T6 | SWD/CLK / POSITION / ^ / ||| | Made By Mc3545dada | MAX Input 45V | Digital Ctrl BUCK | VIN
